# Altium schematic sheet ALLPRINT-CAPBOARD-677512-ENCODER-INPUT.SchDoc
size A3; Organization: Altium Limited; Address1: 3 Minna Close; Address2: Belrose; Address3: NSW 2085; Address4: Australia; DocumentNumber: 12; SheetNumber: 10; SheetTotal: 11
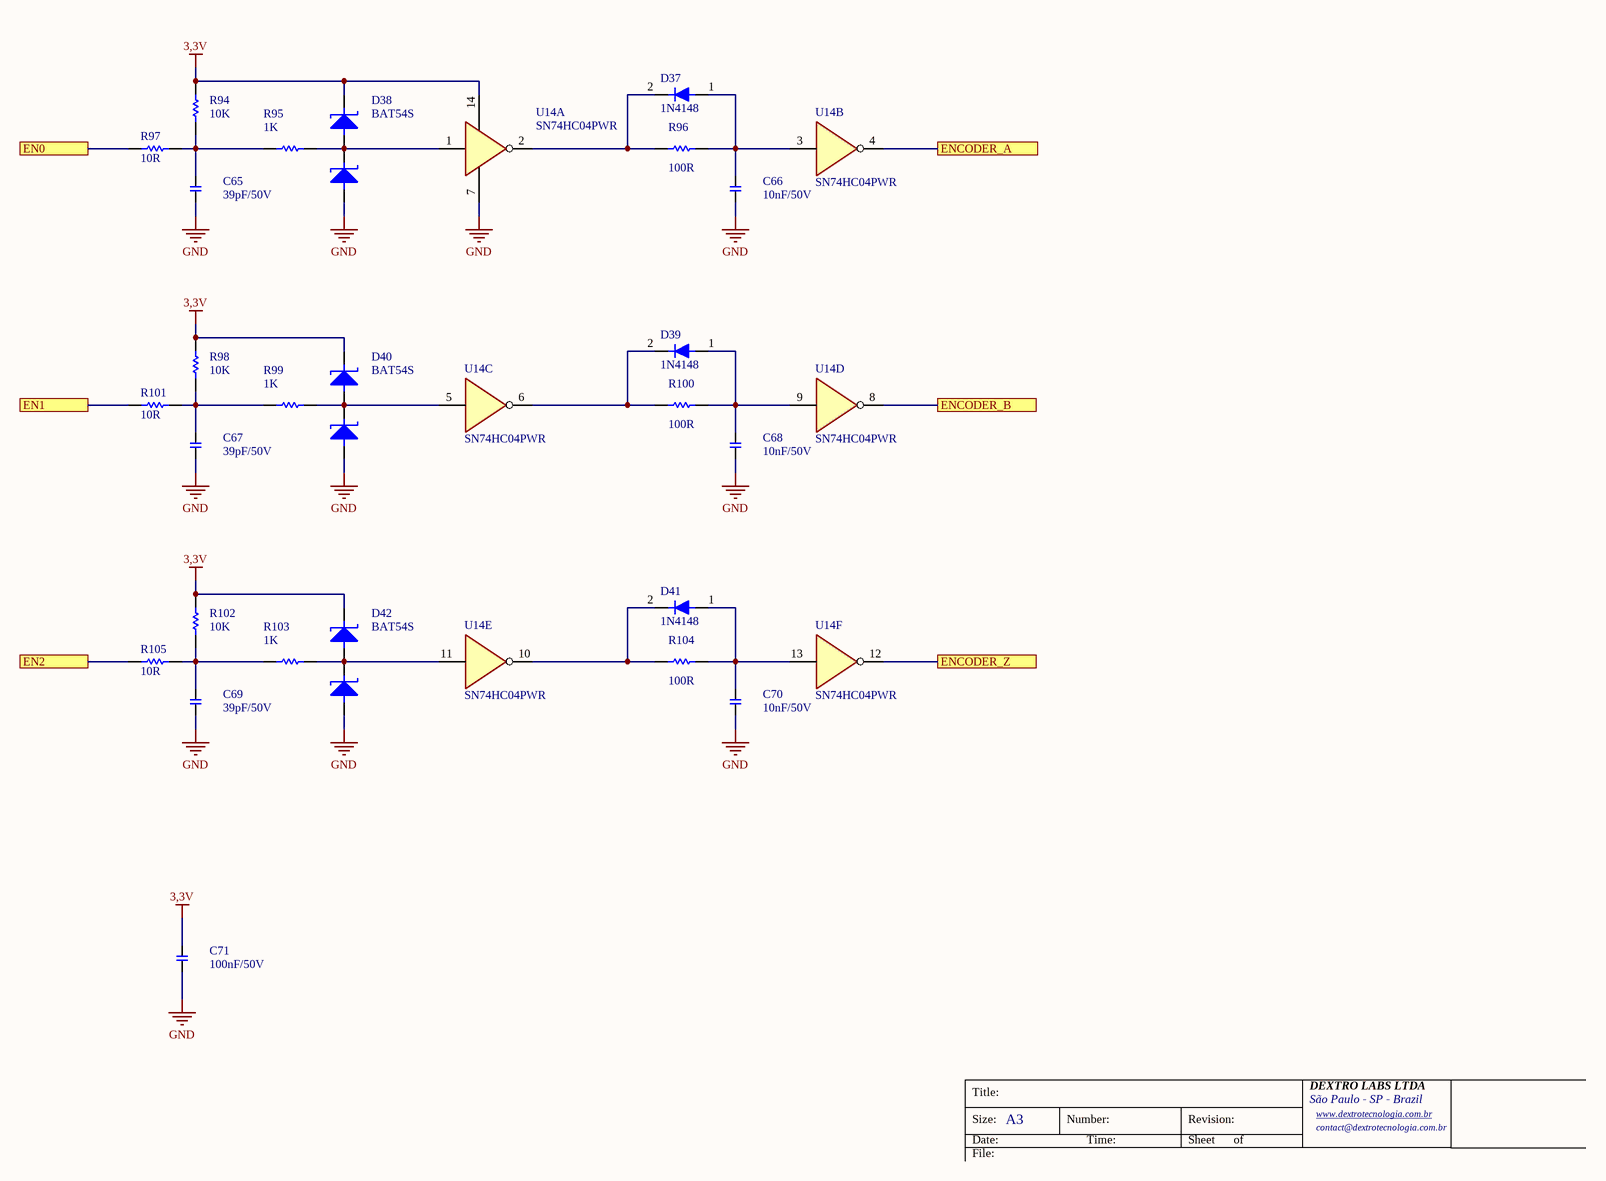
[diagram p0: ALLPRINT-CAPBOARD-677512-ENCODER-INPUT.SchDoc]

## Parts
C65  39pF/50V  [CAP-0603]
C66  10nF/50V  [CAP-0603]
C67  39pF/50V  [CAP-0603]
C68  10nF/50V  [CAP-0603]
C69  39pF/50V  [CAP-0603]
C70  10nF/50V  [CAP-0603]
C71  100nF/50V  [CAP-0603]
D37  1N4148  [SOD123]
D38  BAT54S  [SOT23-3]
D39  1N4148  [SOD123]
D40  BAT54S  [SOT23-3]
D41  1N4148  [SOD123]
D42  BAT54S  [SOT23-3]
R94  10K  [RES-0805]
R95  1K  [RES-0603]
R96  100R  [RES-0603]
R97  10R  [RES-0603]
R98  10K  [RES-0805]
R99  1K  [RES-0603]
R100  100R  [RES-0603]
R101  10R  [RES-0603]
R102  10K  [RES-0805]
R103  1K  [RES-0603]
R104  100R  [RES-0603]
R105  10R  [RES-0603]
U14  SN74HC04PWR  [TSSOP-14]  (parts A,B,C,D,E,F of 6)

## Ports
EN0 (see ALLPRINT-CAPBOARD-677512-GENERAL[4C]), EN1 (see ALLPRINT-CAPBOARD-677512-GENERAL[4C]), EN2 (see ALLPRINT-CAPBOARD-677512-GENERAL[4C]), ENCODER_A (see ALLPRINT-CAPBOARD-677512-GENERAL[3C], ALLPRINT-CAPBOARD-677512-MCU[5B]), ENCODER_B (see ALLPRINT-CAPBOARD-677512-GENERAL[3C], ALLPRINT-CAPBOARD-677512-MCU[5B]), ENCODER_Z (see ALLPRINT-CAPBOARD-677512-GENERAL[3C], ALLPRINT-CAPBOARD-677512-MCU[5B])

## Nets
3,3V: C71.2 D38.2 D40.2 D42.2 R94.2 R98.2 R102.2 U14.14(VCC)
GND: C65.1 C66.1 C67.1 C68.1 C69.1 C70.1 C71.1 D38.1 D40.1 D42.1 U14.7(GND)
EN0: R97.1 ; port EN0
EN1: R101.1 ; port EN1
EN2: R105.1 ; port EN2
ENCODER_A: U14.4(4Y) ; port ENCODER_A
ENCODER_B: U14.8 ; port ENCODER_B
ENCODER_Z: U14.12 ; port ENCODER_Z
NetC65_2: C65.2 R94.1 R95.1 R97.2
NetC66_2: C66.2 D37.1(A1) R96.2 U14.3(4A)
NetC67_2: C67.2 R98.1 R99.1 R101.2
NetC68_2: C68.2 D39.1(A1) R100.2 U14.9
NetC69_2: C69.2 R102.1 R103.1 R105.2
NetC70_2: C70.2 D41.1(A1) R104.2 U14.13
NetD37_2: D37.2(K) R96.1 U14.2
NetD38_3: D38.3 R95.2 U14.1(1A)
NetD39_2: D39.2(K) R100.1 U14.6
NetD40_3: D40.3 R99.2 U14.5
NetD41_2: D41.2(K) R104.1 U14.10
NetD42_3: D42.3 R103.2 U14.11

## Notes on the sheet
- Title:
- Size:
- Date:
- A3
- Number:
- Time:
- Revision:
- Sheet
- of
- DEXTRO LABS LTDA
- São Paulo - SP - Brazil
- www.dextrotecnologia.com.br <http://www.dextrotecnologia.com.br>
- contact@dextrotecnologia.com.br
- File:

## Library data of the parts
C65 C67 C69 = CAP-39pF/50V-0603-X7R-MLCC: 50V 39pF X7R ±10% 0603 Multilayer Ceramic Capacitors MLCC - SMD/SMT ROHS; LCSC: C107049
C66 C68 C70 = CAP-10nF/50V-0603-X7R-MLCC: 50V 10nF X7R ±10% 0603 Multilayer Ceramic Capacitors MLCC - SMD/SMT ROHS; LCSC: C1589
C71 = CAP-100nF/50V-0603-X7R-MLCC: 50V 100nF X7R ±10% 0603 Multilayer Ceramic Capacitors MLCC - SMD/SMT ROHS; LCSC: C14663
D37 D39 D41 = 1N4148: 1A 4ns 75V Independent 1V@50mA 150mA SOD-123 Single Diodes RoHS; LCSC: C241939
D38 D40 D42 = BAT54S: 30V Dual 200mA 800mV@100mA SOT-23 Schottky Barrier Diodes (SBD) ROHS; LCSC: C916425
R94 R98 R102 = RES-10K-1%-125mW-0805: 100mW Thick Film Resistor 75V ±100ppm/℃ ±1% 10K Chip Resistor - Surface Mount ROHS; LCSC: C84376
R95 R99 R103 = RES-1K-1%-100mW-0603: 100mW Thick Film Resistor 75V ±100ppm/℃ ±1% 1kΩ 0603 Chip Resistor - Surface Mount ROHS; LCSC: C22548
R96 R100 R104 = RES-100R-1%-100mW-0603: 100mW Thick Film Resistor 75V ±100ppm/℃ ±1% 100Ω 0603 Chip Resistor - Surface Mount ROHS; LCSC: C105588
R97 R101 R105 = RES-10R-1%-100mW-0603: 100mW Thick Film Resistor 75V ±1% ±400ppm/℃ 10Ω 0603 Chip Resistor - Surface Mount ROHS; LCSC: C22859
U14 = SN74HC04PWR: 2V~6V 16ns@6V,50pF 2uA 6 1 TSSOP-14 Gates and Inverters RoHS; LCSC: C6810